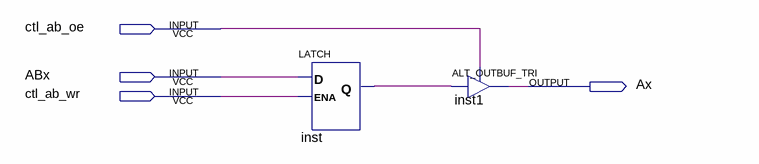
[diagram p0: schematic sheet]
// Quartus schematic addresspin.bdf as structural Verilog: 2 symbols, 4 pins
module addresspin (
  input  ctl_ab_oe,
  input  ABx,
  input  ctl_ab_wr,
  output Ax
);

  wire inst_q;

  LATCH inst (.D(ABx), .ENA(ctl_ab_wr), .Q(inst_q));
  ALT_OUTBUF_TRI inst1 (.i(inst_q), .oe(ctl_ab_oe), .o(Ax));
endmodule
